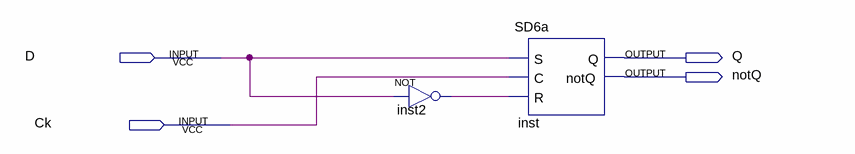
[diagram p0: schematic sheet]
// Quartus schematic flip-flop-d.bdf as structural Verilog: 2 symbols, 4 pins
module \flip-flop-d  (
  input  D,
  input  Ck,
  output Q,
  output notQ
);

  wire inst2_out;

  not inst2 (inst2_out, D);
  SD6a inst (.S(D), .C(Ck), .R(inst2_out), .Q(Q), .notQ(notQ));
endmodule
